# EasyEDA schematic SCH_Broke-Knomi_2026-06-14.json
TITLE: Sheet_1; REV: 1.0; Date: 2026-06-02; Sheet: 1/1; Drawn By: lastsurvivor857; Company: Your Company
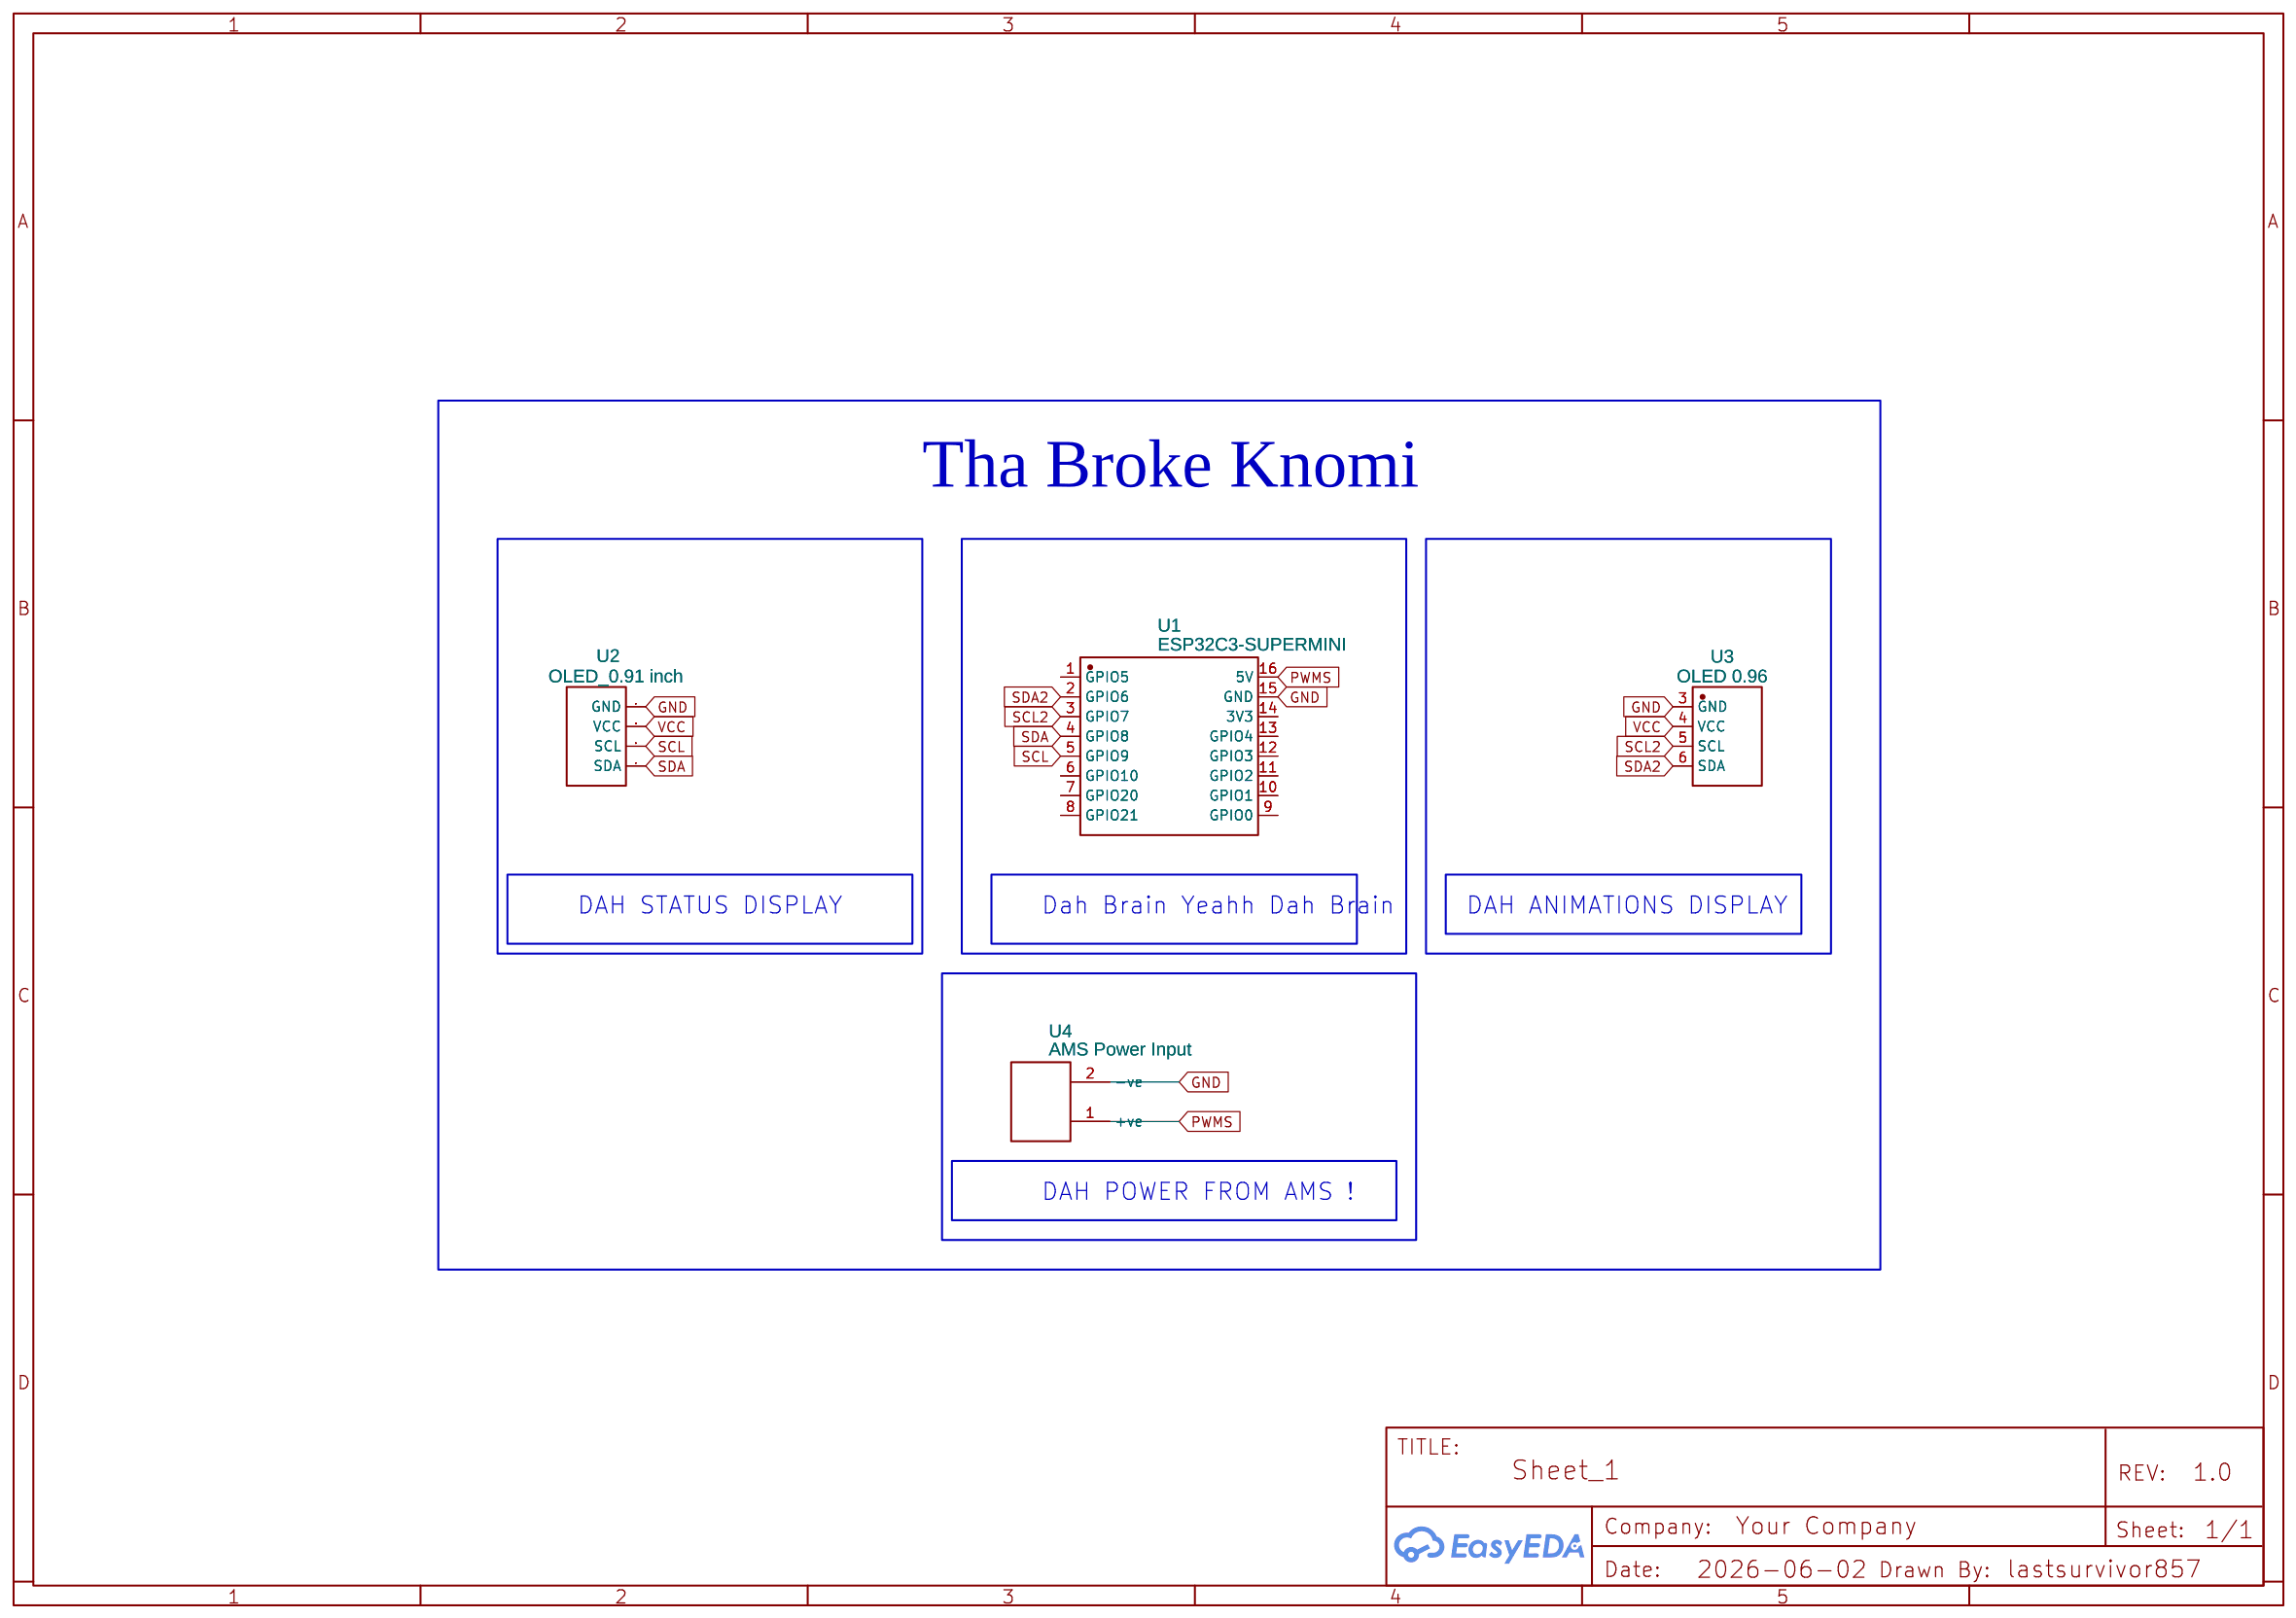
[diagram p0: schematic sheet]

## Parts
U1  ESP32C3-SUPERMINI  [COMM-SMD_16P-L22.5-W18.0-P2.54-TL]
U2  OLED_0.91 inch  [OLED_0.91 INCH]
U3  OLED 0.96  [OLED-TH_OLED0.96-I2C]
U4  AMS Power Input  [BATTERY TERMINAL]

## Library data of the parts
U1 = ESP32C3-SUPERMINI: Supplier: LCSC; Supplier Part: C9900147397; Manufacturer: null; Manufacturer Part: ESP32C3-SuperMini; JLCPCB Part Class: Extended Part; Contributor: lcsc
U2 = OLED_0.91 inch: Contributor: Maulik Shah
U3 = OLED 0.96 COPY: Supplier Part: AZDelivery; Manufacturer: AZDelivery; Manufacturer Part: ZJY096S0700BG01蓝色; link: https://img.jlc.com/pdf/applyPasteComponent/2022-08-15/203417A/337c2d88c1b34c958220578f8c1ccd46/ZJY096S0700WG01.pdf; Contributor: tonysandberg69
U4 = Battery Terminal: Contributor: positive.ptsb

## Nets
GND: U1.15(GND) U2.4(GND) U3.3(GND) U4.2(-ve)
VCC: U2.3(VCC) U3.4(VCC)
PWMS: U1.16(5V) U4.1(+ve)
SCL: U1.5(GPIO9) U2.2(SCL)
SCL2: U1.3(GPIO7) U3.5(SCL)
SDA: U1.4(GPIO8) U2.1(SDA)
SDA2: U1.2(GPIO6) U3.6(SDA)

Not connected (* = marked no-connect by the designer): U1 1(GPIO5) 6(GPIO10) 7(GPIO20) 8(GPIO21) 9(GPIO0) 10(GPIO1) 11(GPIO2) 12(GPIO3) 13(GPIO4) 14(3V3)

## Notes on the sheet
- Tha Broke Knomi
- DAH STATUS DISPLAY
- Dah Brain Yeahh Dah Brain
- DAH ANIMATIONS DISPLAY
- DAH POWER FROM AMS !
